# Altium schematic sheet whte_noise.SchDoc
size A4
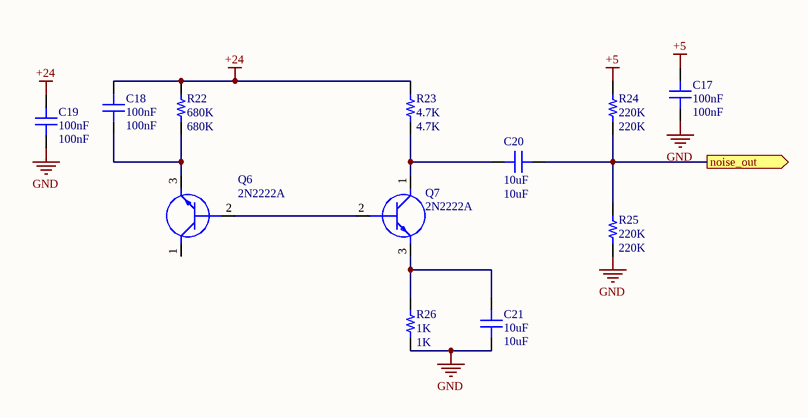
[diagram p0: whte_noise.SchDoc]

## Parts
C17  100nF  [cap805]
C18  100nF  [cap805]
C19  100nF  [cap805]
C20  10uF  [cap805]
C21  10uF  [cap805]
Q6  2N2222A  [soT95p280x130-3n]
Q7  2N2222A  [soT95p280x130-3n]
R22  680K  [0603R]
R23  4.7K  [0603R]
R24  220K  [0603R]
R25  220K  [0603R]
R26  1K  [0603R]

## Ports
noise_out (out)

## Nets
+5: C17.1 R24.2
+24: C18.2 C19.1 R22.2 R23.2
GND: C17.2 C19.2 C21.1 R25.1 R26.1
noise_out: C20.1 R24.1 R25.2 ; port noise_out
NetC18_1: C18.1 Q6.3(E) R22.1
NetC20_2: C20.2 Q7.1(C) R23.1
NetC21_2: C21.2 Q7.3(E) R26.2
NetQ6_2: Q6.2(B) Q7.2(B)

Not connected (* = marked no-connect by the designer): Q6 1(C)

## Library data of the parts
C17-C21 = Capacitor: CAP SMD 0805; Part Number: C0805X106K9RAC7800
  C17-C19: Value: 100nF
  C20 C21: Value: 10uF
Q6 Q7 = 2N2222A: Transistor BJT NPN SMD; pin to pad: 1>3 2>1 3>2; Manufacturer_Name: Foshan Blue Rocket Elec; Datasheet Link: https://datasheet.lcsc.com/szlcsc/1901291437_Foshan-Blue-Rocket-Elec-2N2222A_C358533.pdf; Height: 4.7mm; Manufacturer_Part_Number: 2N2222A
R22-R26 = Resistor: RES SMD 0603; Part Number: RCS0805100KFKEA
  R22: Value: 680K
  R23: Value: 4.7K
  R24 R25: Value: 220K
  R26: Value: 1K